# EAGLE design buck (EAGLE 6.5.0)
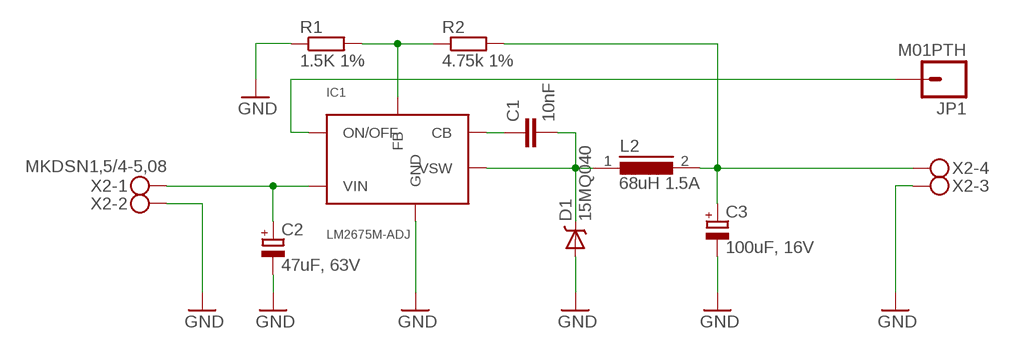
[diagram p0: schematic, sheet 1]

## Parts
C1  10nF  C-EUC0805  [C0805]
C2  47uF, 63V  CPOL-EUF  [PANASONIC_F]
C3  100uF, 16V  CPOL-EUD  [PANASONIC_D]
D1  15MQ040  DIODE-SCHOTTKY-MBRA140  [SMA-DIODE]
IC1  LM2675M-ADJ  LM2674  [SO-08]
JP1  M01PTH  [1X01]
L2  68uH 1.5A  DR125  [DR125]
R1  1.5K 1%  R-EU_R0805W  [R0805W]
R2  4.75k 1%  R-EU_R0805W  [R0805W]
X2  MKDSN1,5/4-5,08  [MKDSN1,5/4-5,08]

## Nets
GND: C2.- C3.- D1.A IC1.6(GND) R1.1 X2.2 X2.3
N$1: IC1.4(FB) R1.2 R2.1
N$2: C1.2 D1.C IC1.8(VSW) L2.1
N$3: C1.1 IC1.1(CB)
N$4: C3.+ L2.2 R2.2 X2.4
N$5: IC1.5(ON/OFF) JP1.1
N$6: C2.+ IC1.7(VIN) X2.1

## Library data of the parts
C1 = rcl:C-EU: CAPACITOR, European symbol
C2 C3 = rcl:CPOL-EU: POLARIZED CAPACITOR, European symbol
D1 = SparkFun-DiscreteSemi:DIODE-SCHOTTKY: Schottky diodes in SFE's production catalog BAT20J 1A 23V 0.62Vf RB751 120mA 40V 0.37Vf PMEG4005EJ 0.5A 40V 0.42Vf MBRA140 1A 40V 0.5Vf B340A 3A 40V SMA; PROD_ID: DIO-08053; VALUE: MBRA140
IC1 = Simplex-ICs:LM2674: LM2674 power converter
JP1 = SparkFun-Connectors:M01: Header 1 Standard 1-pin 0.1" header. Use with straight break away headers (SKU : PRT-00116), right angle break away headers (PRT-00553), swiss pins (PRT-00743), machine pins (PRT-00117), and female headers (PRT-00115).
L2 = inductors:DR125: High Power Density, High Efficiency, Shielded Inductors Source: coiltronics_dr_series.pdf
R1 R2 = rcl:R-EU_: RESISTOR, European symbol
X2 = con-phoenix-508:MKDSN1,5/4-5,08: MKDSN 1,5/ 4-5,08 Printklemme Nennstrom: 13,5 A Nennspannung: 250 V Rastermaß: 5,08 mm Polzahl: 4 Anschlussart: Schraubanschluss Montage: Löten Anschlussrichtung Leiter/Platine: 0 ° Artikelnummer: 1729144 Source: http://eshop.phoenixcontact.com .. 1729144.pdf; MPN: SMKDSN1,5/4-5,08; OC_FARNELL: 1792905; OC_NEWARK: 70R0300

## Board
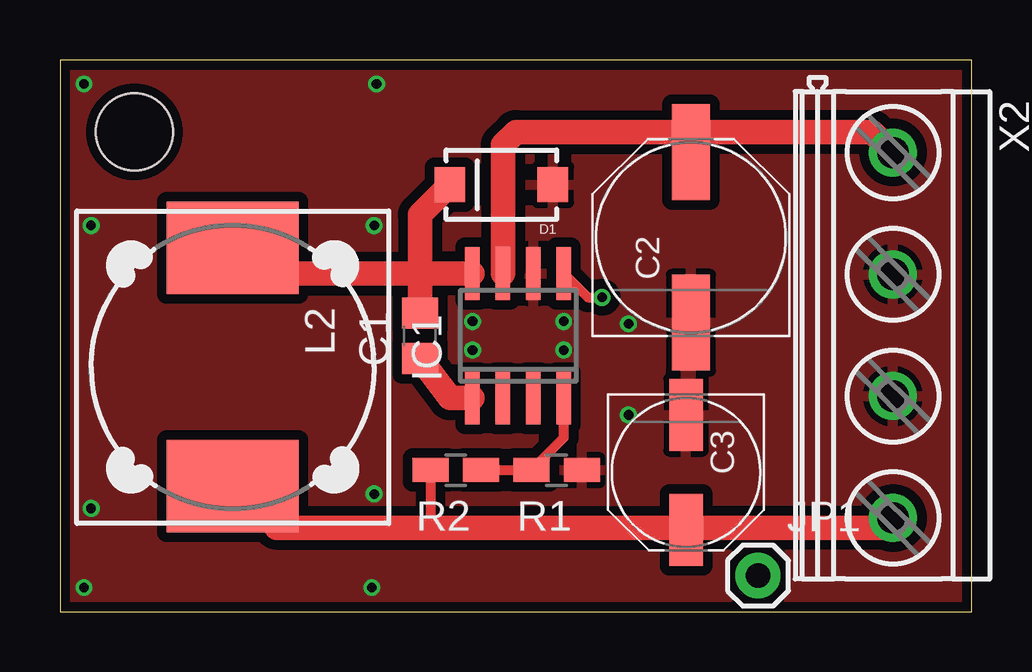
[diagram p1: board, top side]
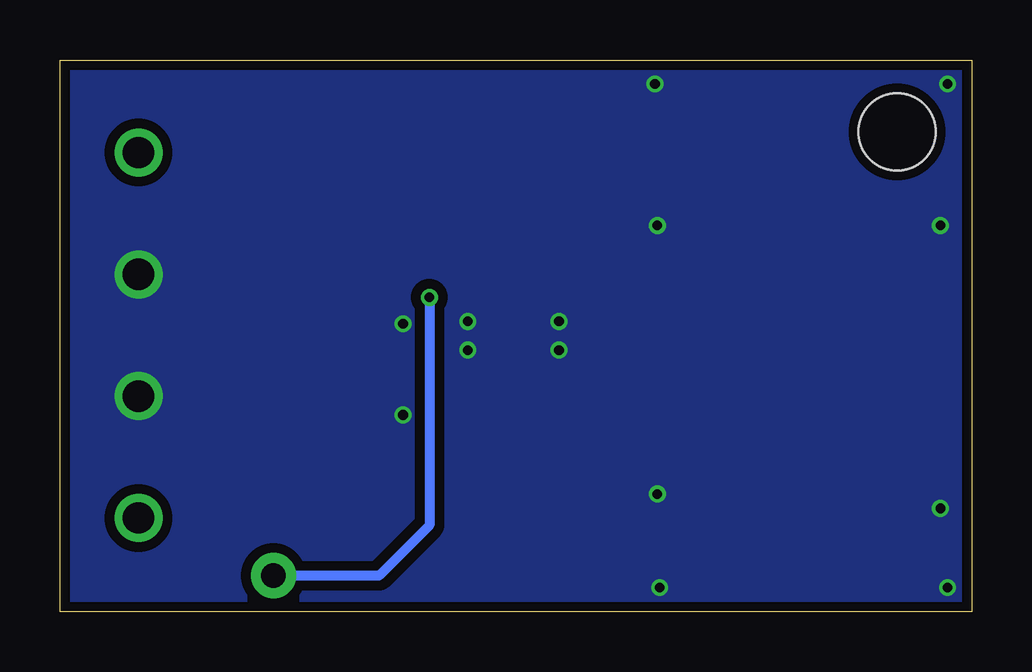
[diagram p2: board, bottom side, seen from below]

Size 38 x 23 mm. Coordinates in mm from the lower left corner, seen from the top.
Outline: 0,0 38,0 38,23 0,23 0,0
Copper layers (1*16): Top 0.035mm / dielectric 1.5mm / Bottom 0.035mm
Design rules "seeedstudio_rules_v1.1 *": minimum track width 6mil, minimum drill 12mil, track to track 6mil, track to pad 6mil, pad to pad 6mil, via to via 6mil, smd to smd 0mil, copper to edge 10mil, drill to drill 10mil, minimum pad ring 0.154mm, minimum via ring 6mil, stop-mask expansion 2mil, vias tented up to drill 100mil, thermal gap 10mil
Holes 3.2 mm at 3.1,20

### Footprints (pad centres in the part's own frame; a part is rotated, then mirrored left to right if it is on the bottom)
C0805 = smd 1.3 x 1.5: 1 -0.95,0; 2 0.95,0
PANASONIC_F = smd 4 x 1.6: + 3.55,0; - -3.55,0
PANASONIC_D = smd 3 x 1.4: + 2.4,0; - -2.4,0
SMA-DIODE = smd 1.27 x 1.47: A -2.15,0; C 2.15,0
SO-08 = smd 0.6 x 2.2: 1 -1.905,-2.6; 2 -0.635,-2.6; 3 0.635,-2.6; 4 1.905,-2.6; 5 1.905,2.6; 6 0.635,2.6; 7 -0.635,2.6; 8 -1.905,2.6
1X01 = drill 1.016 pad 1.88: 1 0,0
DR125 = smd 3.85 x 5.5: 1 -4.975,0; 2 4.975,0
R0805W = smd 1.5 x 1: 1 -1.052,0; 2 1.052,0
MKDSN1,5/4-5,08 = drill 1.3 pad 2: 1 -7.641,0.025; 2 -2.561,0.025; 3 2.519,0.025; 4 7.599,0.025

### Placement (x,y rotation side)
C1  15,11.5 90 top
C2  26.3,15.6 90 top
C3  26.1,5.8 270 top
D1  18.4,17.8 180 top
IC1  19.1,11.5 0 top
JP1  29.1,1.5 0 top
L2  7.2,10.2 270 top
R1  20.7,5.9 180 top
R2  16.5,5.9 180 top
X2  34.7,11.5 270 top

### Tracks (layer width: path | path; a pad name or v marks a point on that pad's centre or on a via)
GND  (via drill 0.4)
  other vias: 1,22 1,1 1.3,16.1 1.3,4.3 13.1,4.9 13.1,16.1 13.2,22 13,1 21,10.9 17.2,12.1 17.2,10.9 21,12.1 23.7,12 23.7,8.2
  pour Top (isolate 0.406): 0,23 38,23 38,0 0,0
  pour Bottom (isolate 0.406, no thermals): 0,23 38,23 38,0 0,0
N$1
  Top 0.406: R2.1 R1.2 21,7.26 IC1.4
N$2
  Top 1.016: IC1.8 15,14.1 | D1.C 15,16.55 C1.2 15,14.1 | L2.1 8.38,14.1 15,14.1
N$3
  Top 1.016: IC1.1 16.25,8.9 C1.1
N$4
  Top 0.406: R2.2 15.45,3.65 15.6,3.5
  Top 1.016: 26.8,3.5 34.32,3.5 X2.4 | 26.8,3.5 C3.+ | L2.2 9.03,3.5 15.6,3.5 26.8,3.5
N$5  (via drill 0.4)
  Top 0.406: IC1.5 22,13.1 v22.6,13.1
  Bottom 0.406: v22.6,13.1 22.6,3.6 24.7,1.5 JP1.1
N$6
  Top 1.016: IC1.7 18.46,19.46 19,20 26.6,20 | 26.6,20 C2.+ | 26.6,20 33.87,20 X2.1

### Text on the board
tDocu: Vin / GND / GND / Vout